# EAGLE design FubarStep_v12 (EAGLE 6.4)
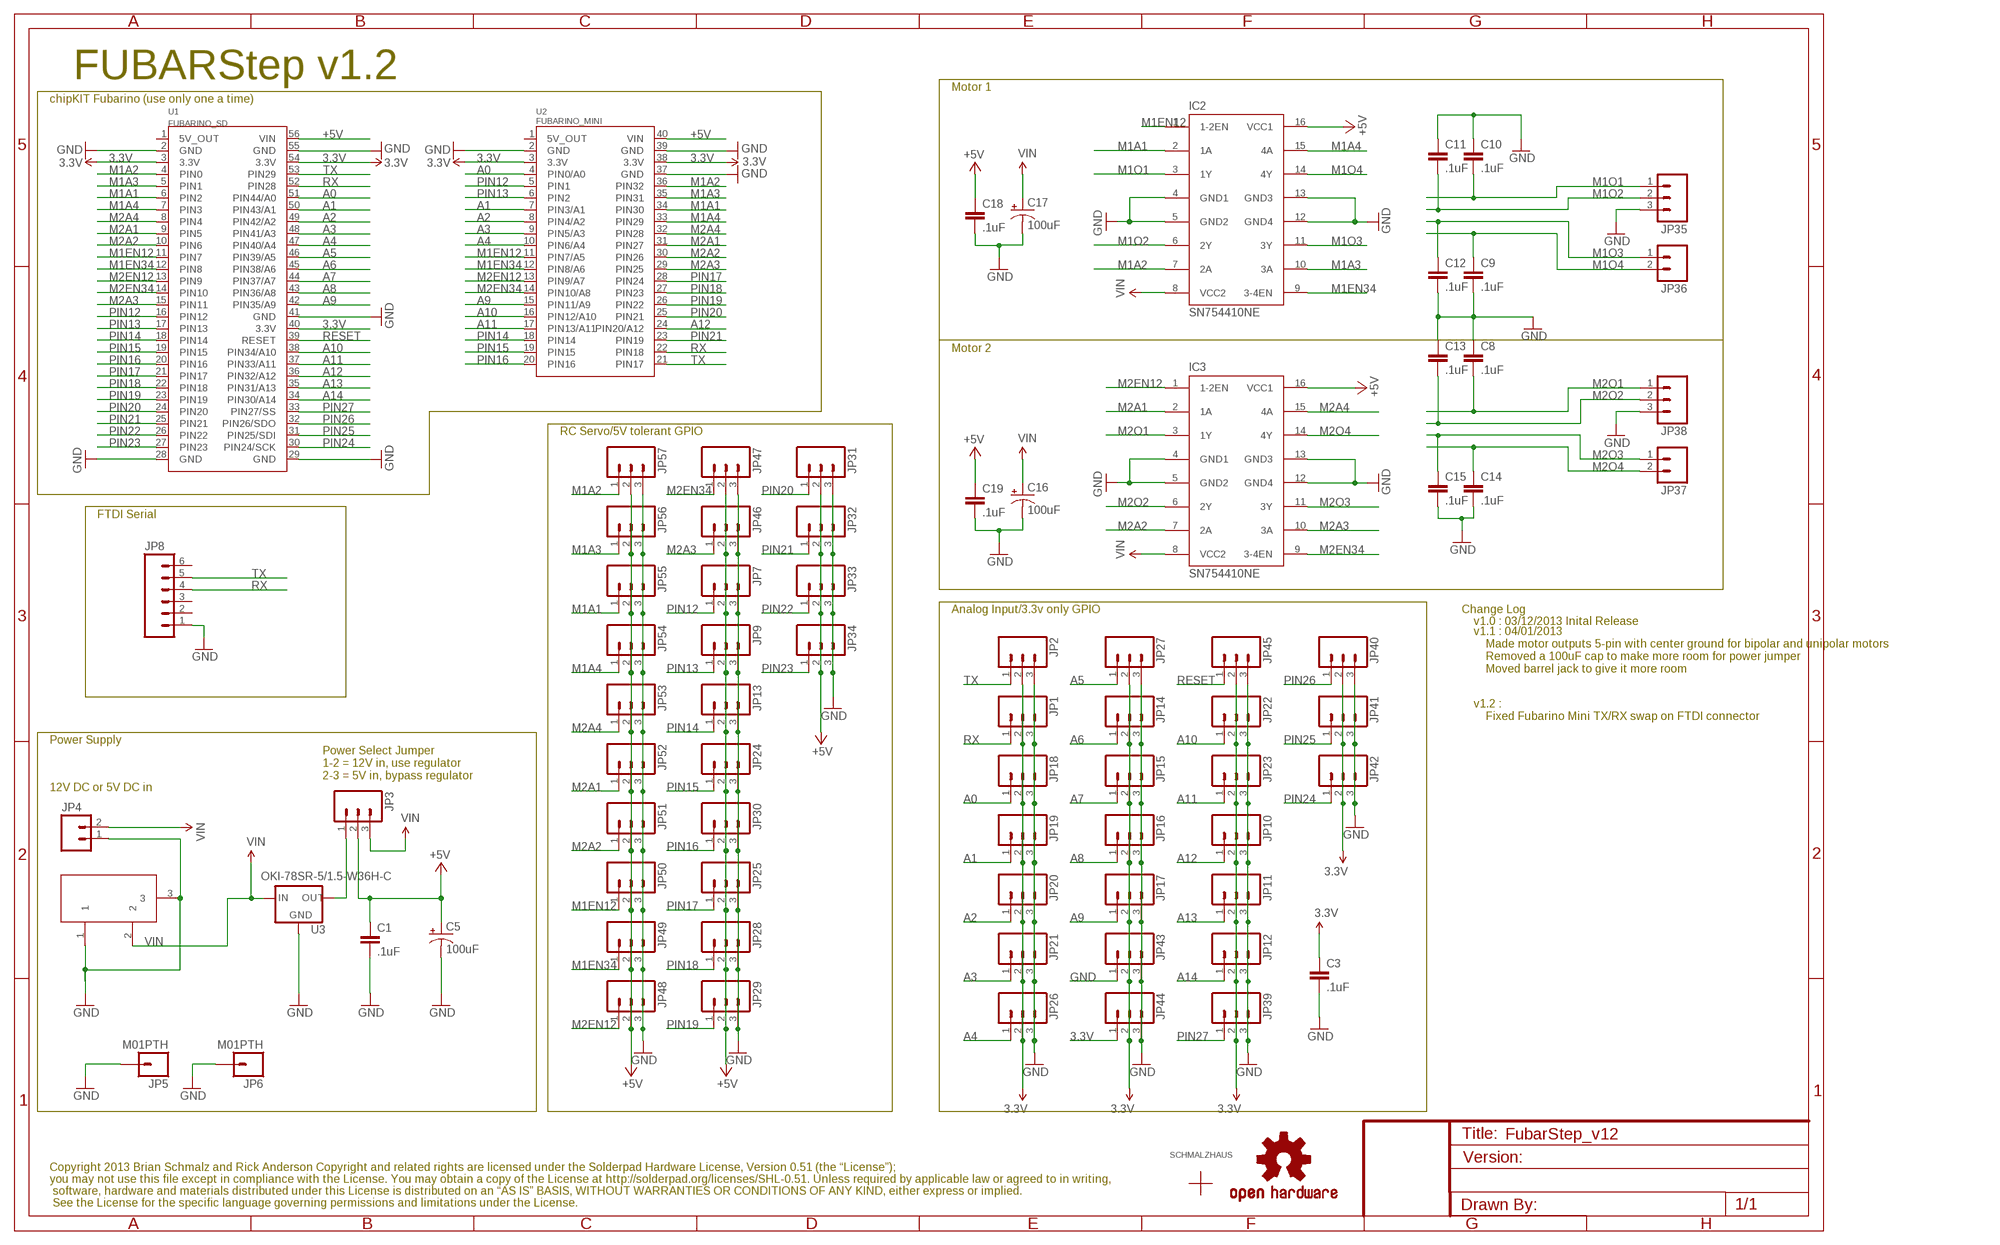
[diagram p0: schematic, sheet 1]

## Parts
C1  .1uF  CAPPTH  [CAP-PTH-SMALL]
C3  .1uF  CAPPTH  [CAP-PTH-SMALL]
C5  100uF  CAP_POLPTH1  [CPOL-RADIAL-100UF-25V]
C8  .1uF  CAPPTH  [CAP-PTH-SMALL]
C9  .1uF  CAPPTH  [CAP-PTH-SMALL]
C10  .1uF  CAPPTH  [CAP-PTH-SMALL]
C11  .1uF  CAPPTH  [CAP-PTH-SMALL]
C12  .1uF  CAPPTH  [CAP-PTH-SMALL]
C13  .1uF  CAPPTH  [CAP-PTH-SMALL]
C14  .1uF  CAPPTH  [CAP-PTH-SMALL]
C15  .1uF  CAPPTH  [CAP-PTH-SMALL]
C16  100uF  CAP_POLPTH1  [CPOL-RADIAL-100UF-25V]
C17  100uF  CAP_POLPTH1  [CPOL-RADIAL-100UF-25V]
C18  .1uF  CAPPTH  [CAP-PTH-SMALL]
C19  .1uF  CAPPTH  [CAP-PTH-SMALL]
IC2  SN754410NE  L293E  [DIL16]
IC3  SN754410NE  L293E  [DIL16]
JP1  M03PTH  [1X03]
JP2  M03PTH  [1X03]
JP3  M03PTH  [1X03]
JP4  M023.5MM  [SCREWTERMINAL-3.5MM-2]
JP5  M01PTH  [1X01]
JP6  M01PTH  [1X01]
JP7  M03PTH  [1X03]
JP8  M06LOCK  [1X06_LOCK]
JP9  M03PTH  [1X03]
JP10  M03PTH  [1X03]
JP11  M03PTH  [1X03]
JP12  M03PTH  [1X03]
JP13  M03PTH  [1X03]
JP14  M03PTH  [1X03]
JP15  M03PTH  [1X03]
JP16  M03PTH  [1X03]
JP17  M03PTH  [1X03]
JP18  M03PTH  [1X03]
JP19  M03PTH  [1X03]
JP20  M03PTH  [1X03]
JP21  M03PTH  [1X03]
JP22  M03PTH  [1X03]
JP23  M03PTH  [1X03]
JP24  M03PTH  [1X03]
JP25  M03PTH  [1X03]
JP26  M03PTH  [1X03]
JP27  M03PTH  [1X03]
JP28  M03PTH  [1X03]
JP29  M03PTH  [1X03]
JP30  M03PTH  [1X03]
JP31  M03PTH  [1X03]
JP32  M03PTH  [1X03]
JP33  M03PTH  [1X03]
JP34  M03PTH  [1X03]
JP35  M03SCREW  [SCREWTERMINAL-3.5MM-3]
JP36  M023.5MM  [SCREWTERMINAL-3.5MM-2]
JP37  M023.5MM  [SCREWTERMINAL-3.5MM-2]
JP38  M03SCREW  [SCREWTERMINAL-3.5MM-3]
JP39  M03PTH  [1X03]
JP40  M03PTH  [1X03]
JP41  M03PTH  [1X03]
JP42  M03PTH  [1X03]
JP43  M03PTH  [1X03]
JP44  M03PTH  [1X03]
JP45  M03PTH  [1X03]
JP46  M03PTH  [1X03]
JP47  M03PTH  [1X03]
JP48  M03PTH  [1X03]
JP49  M03PTH  [1X03]
JP50  M03PTH  [1X03]
JP51  M03PTH  [1X03]
JP52  M03PTH  [1X03]
JP53  M03PTH  [1X03]
JP54  M03PTH  [1X03]
JP55  M03PTH  [1X03]
JP56  M03PTH  [1X03]
JP57  M03PTH  [1X03]
LOGO1  OSHW-LOGOM  [OSHW-LOGO-M]
U1  FUBARINO_SD  [FUBARINO_SD]
U2  FUBARINO_MINI  [FUBARINO_MINI]
U3  OKI-78SR-5/1.5-W36H-C  V_REG_78XXSINK  [TO220-IGO]
U$1  SCHMALZHAUSSCHMALZHAUS_SMALL  [SCHMALZHAUS_SMALL]
X1  DC21MMX  [DC-21MM]

## Nets
3.3V: C3.1 JP1.2 JP2.2 JP10.2 JP11.2 JP12.2 JP14.2 JP15.2 JP16.2 JP17.2 JP18.2 JP19.2 JP20.2 JP21.2 JP22.2 JP23.2 JP26.2 JP27.2 JP39.2 JP40.2 JP41.2 JP42.2 JP43.2 JP44.1 JP44.2 JP45.2 U1.3(3.3V) U1.40(3.3V) U1.54(3.3V) U2.3(3.3V) U2.38(3.3V)
+5V: C1.1 C5.1(+) C18.1 C19.1 IC2.16(VCC1) IC3.16(VCC1) JP3.2 JP7.2 JP9.2 JP13.2 JP24.2 JP25.2 JP28.2 JP29.2 JP30.2 JP31.2 JP32.2 JP33.2 JP34.2 JP46.2 JP47.2 JP48.2 JP49.2 JP50.2 JP51.2 JP52.2 JP53.2 JP54.2 JP55.2 JP56.2 JP57.2 U1.56(VIN) U2.40(VIN)
A0: JP18.1 U1.51(PIN44/A0) U2.4(PIN0/A0)
A1: JP19.1 U1.50(PIN43/A1) U2.7(PIN3/A1)
A2: JP20.1 U1.49(PIN42/A2) U2.8(PIN4/A2)
A3: JP21.1 U1.48(PIN41/A3) U2.9(PIN5/A3)
A4: JP26.1 U1.47(PIN40/A4) U2.10(PIN6/A4)
A5: JP27.1 U1.46(PIN39/A5)
A6: JP14.1 U1.45(PIN38/A6)
A7: JP15.1 U1.44(PIN37/A7)
A8: JP16.1 U1.43(PIN36/A8)
A9: JP17.1 U1.42(PIN35/A9) U2.15(PIN11/A9)
A10: JP22.1 U1.38(PIN34/A10) U2.16(PIN12/A10)
A11: JP23.1 U1.37(PIN33/A11) U2.17(PIN13/A11)
A12: JP10.1 U1.36(PIN32/A12) U2.24(PIN20/A12)
A13: JP11.1 U1.35(PIN31/A13)
A14: JP12.1 U1.34(PIN30/A14)
GND: C1.2 C3.2 C5.2(-) C8.1 C9.2 C10.1 C11.1 C12.2 C13.1 C14.2 C15.2 C16.2(-) C17.2(-) C18.2 C19.2 IC2.4(GND1) IC2.5(GND2) IC2.12(GND4) IC2.13(GND3) IC3.4(GND1) IC3.5(GND2) IC3.12(GND4) IC3.13(GND3) JP1.3 JP2.3 JP4.1 JP5.1 JP6.1 JP7.3 JP8.1 JP9.3 JP10.3 JP11.3 JP12.3 JP13.3 JP14.3 JP15.3 JP16.3 JP17.3 JP18.3 JP19.3 JP20.3 JP21.3 JP22.3 JP23.3 JP24.3 JP25.3 JP26.3 JP27.3 JP28.3 JP29.3 JP30.3 JP31.3 JP32.3 JP33.3 JP34.3 JP35.3 JP38.3 JP39.3 JP40.3 JP41.3 JP42.3 JP43.1 JP43.3 JP44.3 JP45.3 JP46.3 JP47.3 JP48.3 JP49.3 JP50.3 JP51.3 JP52.3 JP53.3 JP54.3 JP55.3 JP56.3 JP57.3 U1.2(GND) U1.28(GND) U1.29(GND) U1.41(GND) U1.55(GND) U2.2(GND) U2.37(GND) U2.39(GND) U3.GND X1.1 X1.3
M1A1: IC2.2(1A) JP55.1 U1.6(PIN2) U2.34(PIN30)
M1A2: IC2.7(2A) JP57.1 U1.4(PIN0) U2.36(PIN32)
M1A3: IC2.10(3A) JP56.1 U1.5(PIN1) U2.35(PIN31)
M1A4: IC2.15(4A) JP54.1 U1.7(PIN3) U2.33(PIN29)
M1EN12: IC2.1(1-2EN) JP50.1 U1.11(PIN7) U2.11(PIN7/A5)
M1EN34: IC2.9(3-4EN) JP49.1 U1.12(PIN8) U2.12(PIN8/A6)
M1O1: C10.2 IC2.3(1Y) JP35.1
M1O2: C11.2 IC2.6(2Y) JP35.2
M1O3: C12.1 IC2.11(3Y) JP36.1
M1O4: C9.1 IC2.14(4Y) JP36.2
M2A1: IC3.2(1A) JP52.1 U1.9(PIN5) U2.31(PIN27)
M2A2: IC3.7(2A) JP51.1 U1.10(PIN6) U2.30(PIN26)
M2A3: IC3.10(3A) JP46.1 U1.15(PIN11) U2.29(PIN25)
M2A4: IC3.15(4A) JP53.1 U1.8(PIN4) U2.32(PIN28)
M2EN12: IC3.1(1-2EN) JP48.1 U1.13(PIN9) U2.13(PIN9/A7)
M2EN34: IC3.9(3-4EN) JP47.1 U1.14(PIN10) U2.14(PIN10/A8)
M2O1: C8.2 IC3.3(1Y) JP38.1
M2O2: C13.2 IC3.6(2Y) JP38.2
M2O3: C15.1 IC3.11(3Y) JP37.1
M2O4: C14.1 IC3.14(4Y) JP37.2
N$2: JP3.1 U3.OUT
PIN12: JP7.1 U1.16(PIN12) U2.5(PIN1)
PIN13: JP9.1 U1.17(PIN13) U2.6(PIN2)
PIN14: JP13.1 U1.18(PIN14) U2.18(PIN14)
PIN15: JP24.1 U1.19(PIN15) U2.19(PIN15)
PIN16: JP30.1 U1.20(PIN16) U2.20(PIN16)
PIN17: JP25.1 U1.21(PIN17) U2.28(PIN24)
PIN18: JP28.1 U1.22(PIN18) U2.27(PIN23)
PIN19: JP29.1 U1.23(PIN19) U2.26(PIN22)
PIN20: JP31.1 U1.24(PIN20) U2.25(PIN21)
PIN21: JP32.1 U1.25(PIN21) U2.23(PIN19)
PIN22: JP33.1 U1.26(PIN22)
PIN23: JP34.1 U1.27(PIN23)
PIN24: JP42.1 U1.30(PIN24/SCK)
PIN25: JP41.1 U1.31(PIN25/SDI)
PIN26: JP40.1 U1.32(PIN26/SDO)
PIN27: JP39.1 U1.33(PIN27/SS)
RESET: JP45.1 U1.39(RESET)
RX: JP1.1 JP8.4 U1.52(PIN28) U2.22(PIN18)
TX: JP2.1 JP8.5 U1.53(PIN29) U2.21(PIN17)
VIN: C16.1(+) C17.1(+) IC2.8(VCC2) IC3.8(VCC2) JP3.3 JP4.2 U3.IN X1.2
Unconnected: JP8.2 JP8.3 JP8.6 U1.1(5V_OUT) U2.1(5V_OUT)

## Notes on the sheet
- FUBARStep v1.2
- Motor 1
- chipKIT Fubarino (use only one a time)
- Motor 2
- RC Servo/5V tolerant GPIO
- FTDI Serial
- Analog Input/3.3v only GPIO | Change Log
- v1.0 : 03/12/2013 Inital Release
- v1.1 : 04/01/2013
      Made motor outputs 5-pin with center ground for bipolar and unipolar motors
      Removed a 100uF cap to make more room for power jumper
      Moved barrel jack to give it more room
- v1.2 :
      Fixed Fubarino Mini TX/RX swap on FTDI connector
- Power Supply
- Power Select Jumper
  1-2 = 12V in, use regulator
  2-3 = 5V in, bypass regulator
- 12V DC or 5V DC in
- Copyright 2013 Brian Schmalz and Rick Anderson Copyright and related rights are licensed under the Solderpad Hardware License, Version 0.51 (the “License”);
- you may not use this file except in compliance with the License. You may obtain a copy of the License at http://solderpad.org/licenses/SHL-0.51. Unless required by applicable law or agreed to in writing,
- software, hardware and materials distributed under this License is distributed on an “AS IS” BASIS, WITHOUT WARRANTIES OR CONDITIONS OF ANY KIND, either express or implied.
- See the License for the specific language governing permissions and limitations under the License.

## Library data of the parts
C1 C3 C8-C15 C18 C19 = SparkFun-Capacitors:CAP: Capacitor Standard 0603 ceramic capacitor, and 0.1" leaded capacitor.
C5 C16 C17 = SparkFun-Capacitors:CAP_POL: Capacitor Polarized These are standard SMD and PTH capacitors. Normally 10uF, 47uF, and 100uF in electrolytic and tantalum varieties. Always verify the external diameter of the through hole cap, it varies with capacity, voltage, and manufacturer. The EIA devices should be standard.
IC2 IC3 = texas:L293E: TI DEVICE; MF: Arrow Electronics; MPN: L293E; OC_FARNELL: 1467711; OC_NEWARK: 89K0732
JP1-JP3 JP7 JP9-JP35 JP38-JP57 = SparkFun-Connectors:M03: Header 3 Standard 3-pin 0.1" header. Use with straight break away headers (SKU : PRT-00116), right angle break away headers (PRT-00553), swiss pins (PRT-00743), machine pins (PRT-00117), and female headers (PRT-00115). Molex polarized connector foot print use with SKU : PRT-08232 with associated crimp pins and housings.
JP4 JP36 JP37 = SparkFun-Connectors:M02: Header 2 Standard 2-pin 0.1" header. Use with straight break away headers (SKU : PRT-00116), right angle break away headers (PRT-00553), swiss pins (PRT-00743), machine pins (PRT-00117), and female headers (PRT-00115). Molex polarized connector foot print use with SKU : PRT-08233 with associated crimp pins and housings.
JP5 JP6 = SparkFun-Connectors:M01: Header 1 Standard 1-pin 0.1" header. Use with straight break away headers (SKU : PRT-00116), right angle break away headers (PRT-00553), swiss pins (PRT-00743), machine pins (PRT-00117), and female headers (PRT-00115).
JP8 = SparkFun-Connectors:M06: Header 6 Standard 6-pin 0.1" header. Use with straight break away headers (SKU : PRT-00116), right angle break away headers (PRT-00553), swiss pins (PRT-00743), machine pins (PRT-00117), and female headers (PRT-00115). Molex polarized connector foot print use with SKU : PRT-08094 with associated crimp pins and housings. NOTES ON THE VARIANTS LOCK and LOCK_LONGPADS... This footprint was designed to help hold the alignment of a through-hole component (i.e. 6-pin header) while soldering it into place. You may notice that each hole has been shifted either up or down by 0.005 of an inch from it's more standard position (which is a perfectly straight line). This slight alteration caused the pins (the squares in the middle) to touch the edges of the holes. Because they are alternating, it causes a "brace" to hold the component in place. 0.005 has proven to be the perfect amount of "off-center" position when using our standard breakaway headers. Although looks a little odd when you look at the bare footprint, once you have a header in there, the alteration is very hard to notice. Also, if you push a header all the way into place, it is covered up entirely on the bottom side. This idea of altering the position of holes to aid alignment will be further integrated into the Sparkfun Library for other footprints. It can help hold any component with 3 or more connection pins.
LOGO1 = SparkFun-Aesthetics:OSHW-LOGO: Open Source Hardware Logo This logo indicates the piece of hardware it is found on incorporates a OSHW license and/or adheres to the definition of open source hardware found here: http://freedomdefined.org/OSHW
U1 = SchmalzHausPublic:FUBARINO_SD
U2 = SchmalzHausPublic:FUBARINO_MINI
U3 = SparkFun-PowerIC:V_REG_78XX: Voltage Regulator Standard 7805 5V regulator. IGO (Input Ground Output). Spark Fun Electronics SKU : COM-00107
U$1 = SchmalzHaus:SCHMALZHAUS
X1 = powersupply:DC21MM

## Net classes
0 default: width 0.152 mm, drill 0.305 mm, clearance 0.152 mm

## Board
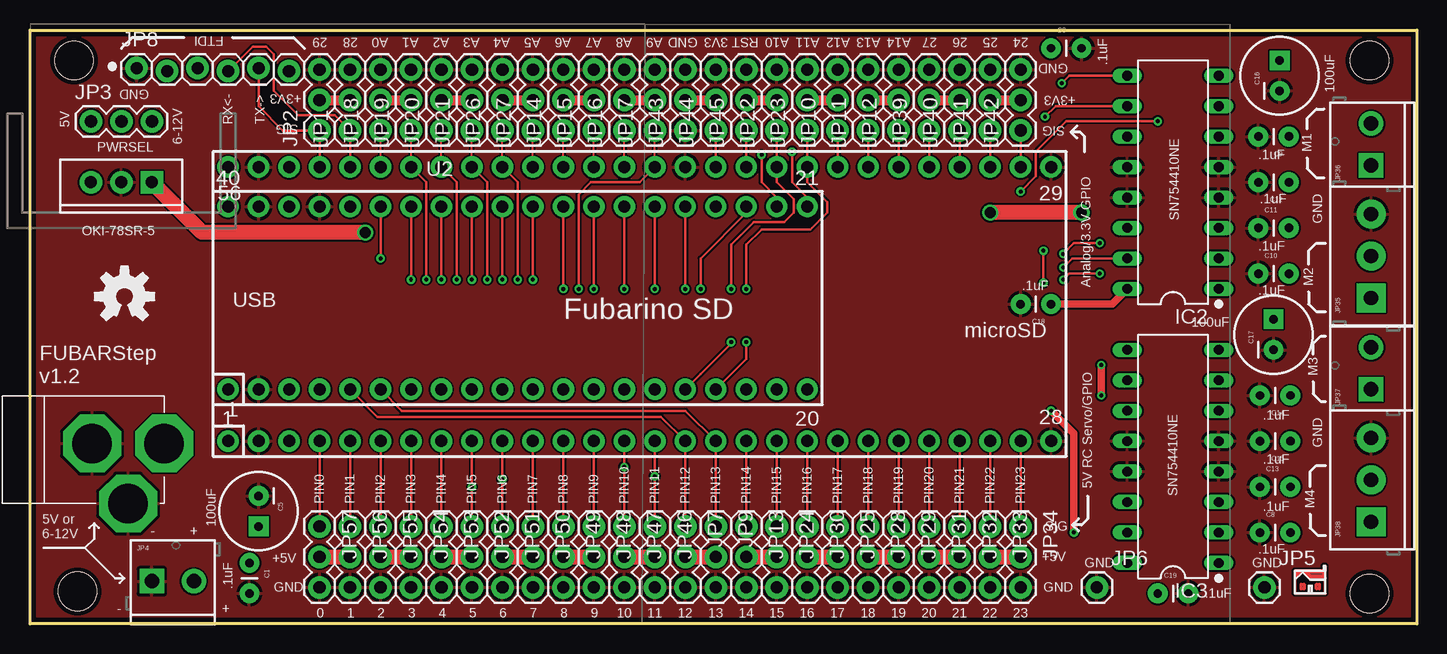
[diagram p1: board, top side]
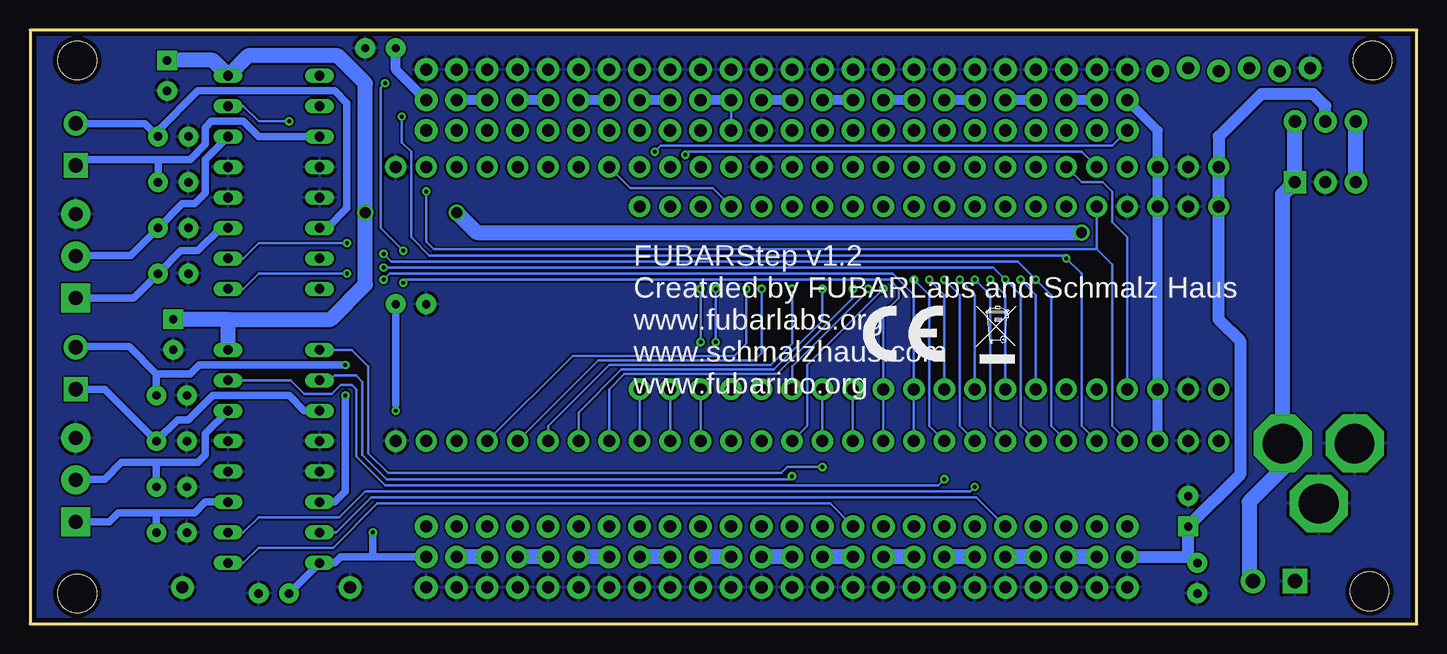
[diagram p2: board, bottom side, seen from below]

Size 115.57 x 49.53 mm. Coordinates in mm from the lower left corner, seen from the top.
Outline: 0,49.53 115.57,49.53 115.57,0 0,0 0,49.53
Copper layers (1*16): Top 0.0356mm / dielectric 1.5011mm / Bottom 0.0356mm
Design rules "LaenPCBOrder_BPSmods": minimum track width 6mil, minimum drill 13mil, track to track 6mil, track to pad 6mil, pad to pad 6mil, via to via 6mil, smd to smd 6mil, copper to edge 15mil, drill to drill 6mil, minimum pad ring 7mil, minimum via ring 7mil, stop-mask expansion 4mil, vias tented up to drill 30mil, thermal gap 10mil
Holes 3.2 mm at 111.63,46.99 111.63,2.54 3.68,46.99 3.95,2.71

### Footprints (pad centres in the part's own frame; a part is rotated, then mirrored left to right if it is on the bottom)
CAP-PTH-SMALL = drill 0.7 pad 1.651: 1 0,0; 2 2.54,0
CPOL-RADIAL-100UF-25V = drill 0.7 pad 1.651 square: 1 1.27,0 | drill 0.7 pad 1.651: 2 -1.27,0
DIL16 = drill 0.813 long: 1 -8.89,-3.81; 2 -6.35,-3.81; 3 -3.81,-3.81; 4 -1.27,-3.81; 5 1.27,-3.81; 6 3.81,-3.81; 7 6.35,-3.81; 8 8.89,-3.81; 9 8.89,3.81; 10 6.35,3.81; 11 3.81,3.81; 12 1.27,3.81; 13 -1.27,3.81; 14 -3.81,3.81; 15 -6.35,3.81; 16 -8.89,3.81
1X03 = drill 1.016 pad 1.88: 1 0,0; 2 2.54,0; 3 5.08,0
SCREWTERMINAL-3.5MM-2 = drill 1.2 pad 2.032 square: 1 0,0 | drill 1.2 pad 2.032: 2 3.5,0
1X01 = drill 1.016 pad 1.88: 1 0,0
1X06_LOCK = drill 1.016 pad 1.88: 1 0,0; 2 2.54,-0.254; 3 5.08,0; 4 7.62,-0.254; 5 10.16,0; 6 12.7,-0.254
SCREWTERMINAL-3.5MM-3 = drill 1.2 pad 2.413 square: 1 0,0 | drill 1.2 pad 2.413: 2 3.5,0; 3 7,0
FUBARINO_SD = drill 1 pad 1.778: 1 -34.29,-11.43; 2 -31.75,-11.43; 3 -29.21,-11.43; 4 -26.67,-11.43; 5 -24.13,-11.43; 6 -21.59,-11.43; 7 -19.05,-11.43; 8 -16.51,-11.43; 9 -13.97,-11.43; 10 -11.43,-11.43; 11 -8.89,-11.43; 12 -6.35,-11.43; 13 -3.81,-11.43; 14 -1.27,-11.43; 15 1.27,-11.43; 16 3.81,-11.43; 17 6.35,-11.43; 18 8.89,-11.43; 19 11.43,-11.43; 20 13.97,-11.43; 21 16.51,-11.43; 22 19.05,-11.43; 23 21.59,-11.43; 24 24.13,-11.43; 25 26.67,-11.43; 26 29.21,-11.43; 27 31.75,-11.43; 28 34.29,-11.43; 29 34.29,11.43; 30 31.75,11.43; 31 29.21,11.43; 32 26.67,11.43; 33 24.13,11.43; 34 21.59,11.43; 35 19.05,11.43; 36 16.51,11.43; 37 13.97,11.43; 38 11.43,11.43; 39 8.89,11.43; 40 6.35,11.43; 41 3.81,11.43; 42 1.27,11.43; 43 -1.27,11.43; 44 -3.81,11.43; 45 -6.35,11.43; 46 -8.89,11.43; 47 -11.43,11.43; 48 -13.97,11.43; 49 -16.51,11.43; 50 -19.05,11.43; 51 -21.59,11.43; 52 -24.13,11.43; 53 -26.67,11.43; 54 -29.21,11.43; 55 -31.75,11.43; 56 -34.29,11.43
FUBARINO_MINI = drill 1 pad 1.778: 1 -24.13,-7.62; 2 -21.59,-7.62; 3 -19.05,-7.62; 4 -16.51,-7.62; 5 -13.97,-7.62; 6 -11.43,-7.62; 7 -8.89,-7.62; 8 -6.35,-7.62; 9 -3.81,-7.62; 10 -1.27,-7.62; 11 1.27,-7.62; 12 3.81,-7.62; 13 6.35,-7.62; 14 8.89,-7.62; 15 11.43,-7.62; 16 13.97,-7.62; 17 16.51,-7.62; 18 19.05,-7.62; 19 21.59,-7.62; 20 24.13,-7.62; 21 24.13,7.62; 22 21.59,7.62; 23 19.05,7.62; 24 16.51,7.62; 25 13.97,7.62; 26 11.43,7.62; 27 8.89,7.62; 28 6.35,7.62; 29 3.81,7.62; 30 1.27,7.62; 31 -1.27,7.62; 32 -3.81,7.62; 33 -6.35,7.62; 34 -8.89,7.62; 35 -11.43,7.62; 36 -13.97,7.62; 37 -16.51,7.62; 38 -19.05,7.62; 39 -21.59,7.62; 40 -24.13,7.62
TO220-IGO = drill 1 pad 1.88: GND 0,0; OUT 2.54,0 | drill 1 pad 1.88 square: IN -2.54,0
DC-21MM = drill 3.302 pad 4.826 octagon: 1 -5.08,-3.353; 2 -0.076,-6.35; 3 -0.076,-0.356

### Placement (x,y rotation side)
C1  18.29,5.08 270 top
C3  85.09,48.01 0 top
C5  19.05,9.4 270 top
C8  102.49,7.62 0 top
C9  104.9,40.64 180 top
C10  102.36,29.21 0 top
C11  102.36,33.02 0 top
C12  104.9,36.83 180 top
C13  102.49,11.43 0 top
C14  105.03,19.05 180 top
C15  105.03,15.24 180 top
C16  104.14,45.72 90 top
C17  103.63,24.13 90 top
C18  85.09,26.67 180 top
C19  93.98,2.54 0 top
IC2  95.25,36.83 90 top
IC3  95.25,13.97 90 top
JP1  26.67,41.15 90 top
JP2  24.13,41.15 90 top
JP3  5.08,41.91 0 top
JP4  10.16,3.56 0 top
JP5  102.87,3.05 0 top
JP6  88.9,3.05 0 top
JP7  54.61,8.13 270 top
JP8  8.89,46.35 0 top
JP9  57.15,8.13 270 top
JP10  67.31,41.15 90 top
JP11  69.85,41.15 90 top
JP12  72.39,41.15 90 top
JP13  59.69,8.13 270 top
JP14  44.45,41.15 90 top
JP15  46.99,41.15 90 top
JP16  49.53,41.15 90 top
JP17  52.07,41.15 90 top
JP18  29.21,41.15 90 top
JP19  31.75,41.15 90 top
JP20  34.29,41.15 90 top
JP21  36.83,41.15 90 top
JP22  62.23,41.15 90 top
JP23  64.77,41.15 90 top
JP24  62.23,8.13 270 top
JP25  67.31,8.13 270 top
JP26  39.37,41.15 90 top
JP27  41.91,41.15 90 top
JP28  69.85,8.13 270 top
JP29  72.39,8.13 270 top
JP30  64.77,8.13 270 top
JP31  74.93,8.13 270 top
JP32  77.47,8.13 270 top
JP33  80.01,8.13 270 top
JP34  82.55,8.13 270 top
JP35  111.76,27.18 90 top
JP36  111.76,38.23 90 top
JP37  111.76,19.56 90 top
JP38  111.76,8.51 90 top
JP39  74.93,41.15 90 top
JP40  77.47,41.15 90 top
JP41  80.01,41.15 90 top
JP42  82.55,41.15 90 top
JP43  54.61,41.15 90 top
JP44  57.15,41.15 90 top
JP45  59.69,41.15 90 top
JP46  52.07,8.13 270 top
JP47  49.53,8.13 270 top
JP48  46.99,8.13 270 top
JP49  44.45,8.13 270 top
JP50  41.91,8.13 270 top
JP51  39.37,8.13 270 top
JP52  36.83,8.13 270 top
JP53  34.29,8.13 270 top
JP54  31.75,8.13 270 top
JP55  29.21,8.13 270 top
JP56  26.67,8.13 270 top
JP57  24.13,8.13 270 top
LOGO1  7.87,27.3 0 top
U1  50.8,26.67 0 top
U2  40.64,27.18 0 top
U3  7.62,36.83 180 top
U$1  106.68,2.54 0 top
U$2  [ROHS_GARBAGE_5MM]  36.7,21.72 0 bottom
U$3  [CE_5MM]  42.8,24.26 0 bottom
X1  4.83,15.11 90 top

### Tracks (layer width: path | path; a pad name or v marks a point on that pad's centre or on a via)
3.3V
  Top 0.203: U1.40 JP44.1
  Top 0.813: JP2.2 JP1.2 | JP18.2 JP19.2 | JP20.2 JP21.2 | JP26.2 JP27.2 | JP14.2 JP15.2 | JP16.2 JP17.2 | JP43.2 JP44.2 | JP45.2 JP22.2 | JP23.2 JP10.2 | JP11.2 JP12.2 | JP39.2 JP40.2 | JP41.2 JP42.2
  Bottom 0.203: JP44.2 JP44.1
  Bottom 0.813: U1.3 U2.3 U2.38 U1.54 21.59,41.15 JP2.2 | JP1.2 JP18.2 | JP19.2 JP20.2 | JP21.2 JP26.2 | JP27.2 JP14.2 | JP15.2 JP16.2 | JP17.2 JP43.2 | JP44.2 JP45.2 | JP22.2 JP23.2 | JP10.2 JP11.2 | JP12.2 JP39.2 | JP40.2 JP41.2 | JP42.2 85.09,46.23 C3.1
+5V  (via drill 0.33)
  Top 0.61: C18.1 90.17,26.67 IC2.16 | v85.09,17.78 87,15.88 v87,7.62
  Top 1.27: JP57.2 JP56.2 | JP55.2 JP54.2 | JP53.2 JP52.2 | JP51.2 JP50.2 | JP49.2 JP48.2 | JP47.2 JP46.2 | JP7.2 JP9.2 | JP13.2 JP24.2 | JP30.2 JP25.2 | JP28.2 JP29.2 | JP31.2 JP32.2 | JP33.2 JP34.2
  Bottom 0.203: 85.09,18.29 v85.09,17.78
  Bottom 0.61: C19.1 IC3.16 90.17,5.08 89.66,5.59 87,5.59 | 85.09,18.29 C18.1 | C1.1 19.05,5.84 19.3,5.59 | JP34.2 87,5.59 | v87,7.62 87,5.59
  Bottom 1.016: 19.05,5.84 C5.1 14.73,12.45 14.73,23.62 16.51,25.4 U2.40 U1.56 16.51,40.64 12.95,44.2 8.64,44.2 7.62,43.18 JP3.2 | JP57.2 19.3,5.59
  Bottom 1.27: JP56.2 JP55.2 | JP54.2 JP53.2 | JP52.2 JP51.2 | JP50.2 JP49.2 | JP48.2 JP47.2 | JP46.2 JP7.2 | JP9.2 JP13.2 | JP24.2 JP30.2 | JP25.2 JP28.2 | JP29.2 JP31.2 | JP32.2 JP33.2
A0
  Top 0.152: U1.51 JP18.1
  Bottom 0.203: U2.4 24.13,32.26 25.4,33.53 25.4,36.07 26.16,36.83 27.94,36.83 U1.51
A1  (via drill 0.33)
  Top 0.152: U1.50 JP19.1
  Top 0.203: v33.02,28.7 33.02,36.83 U1.50
  Bottom 0.203: U2.7 31.75,27.43 v33.02,28.7
A2  (via drill 0.33)
  Top 0.152: U1.49 JP20.1
  Top 0.203: v35.56,28.7 35.56,36.83 U1.49
  Bottom 0.203: U2.8 34.29,27.43 v35.56,28.7
A3  (via drill 0.33)
  Top 0.152: U1.48 JP21.1
  Top 0.203: v38.1,28.7 38.1,36.83 U1.48
  Bottom 0.203: U2.9 36.83,27.43 v38.1,28.7
A4  (via drill 0.33)
  Top 0.152: U1.47 JP26.1
  Top 0.203: v40.64,28.7 40.64,36.83 U1.47
  Bottom 0.203: U2.10 39.37,27.43 v40.64,28.7
A5
  Top 0.152: U1.46 JP27.1
A6
  Top 0.152: U1.45 JP14.1
A7
  Top 0.152: U1.44 JP15.1
A8
  Top 0.152: U1.43 JP16.1
A9  (via drill 0.33)
  Top 0.152: U1.42 JP17.1
  Top 0.203: v45.72,27.94 45.72,35.81 46.74,36.83 50.8,36.83 U1.42
  Bottom 0.203: U2.15 52.07,21.46 45.72,27.81 v45.72,27.94
A10  (via drill 0.33)
  Top 0.203: U2.16 55.88,20.83 58.42,23.37 v58.42,23.5 | v58.42,27.94 58.42,31.62 60.33,33.53 62.87,33.53 63.63,34.29 63.63,35.43 62.23,36.83 U1.38 JP22.1
  Bottom 0.203: v58.42,23.5 v58.42,27.94
A11  (via drill 0.33)
  Top 0.203: U2.17 59.69,22.1 v59.69,23.5 | v59.69,27.94 59.69,31.62 60.96,32.89 65.02,32.89 66.42,34.29 66.42,35.18 64.77,36.83 U1.37 JP23.1
  Bottom 0.203: v59.69,23.5 v59.69,27.94
A12
  Top 0.203: JP10.1 U1.36
  Bottom 0.203: U2.24 58.67,36.32 65.53,36.32 U1.36
A13
  Top 0.203: JP11.1 U1.35
A14
  Top 0.203: JP12.1 U1.34
GND
  pour Bottom (rank 2): 0,49.53 115.57,49.53 115.57,0 0,0
  pour Top (rank 2): 0,49.53 115.57,49.53 115.57,0 0,0
M1A1  (via drill 0.33)
  Top 0.203: v89.15,31.75 87,31.75 v86.11,30.86 | U2.34 v31.75,28.7 | U1.6 JP55.1
  Bottom 0.203: IC2.2 97.79,30.48 96.52,31.75 v89.15,31.75 | v86.11,30.86 85.47,30.23 33.27,30.23 v31.75,28.7 30.48,27.43 30.48,16.51 U1.6
M1A2  (via drill 0.33)
  Top 0.203: v93.98,41.91 86.36,41.91 83.82,39.37 83.82,37.34 v82.55,36.07 | U1.4 JP57.1
  Bottom 0.203: IC2.7 97.79,43.18 96.52,41.91 v93.98,41.91 | v82.55,36.07 82.55,31.88 81.92,31.24 26.67,31.24 | U1.4 25.4,16.51 25.4,29.97 26.67,31.24 | 26.67,31.24 U2.36
M1A3  (via drill 0.33)
  Top 0.203: IC2.10 85.47,43.18 v84.58,42.29 | U2.35 v29.21,30.48 | U1.5 JP56.1
  Bottom 0.203: v84.58,42.29 84.58,40.13 83.82,39.37 83.82,32.26 82.3,30.73 29.46,30.73 v29.21,30.48 27.94,29.21 27.94,16.51 U1.5
M1A4  (via drill 0.33)
  Top 0.203: IC2.15 86.87,30.48 v86.11,29.72 | U2.33 v34.29,28.7 | U1.7 JP54.1
  Bottom 0.203: U1.7 33.02,16.51 33.02,27.43 v34.29,28.7 35.31,29.72 v86.11,29.72
M1EN12  (via drill 0.33)
  Top 0.203: v89.15,29.21 86.61,29.21 v86.11,28.7 | U1.11 JP50.1
  Bottom 0.203: IC2.1 97.79,27.94 96.52,29.21 v89.15,29.21 | v86.11,28.7 85.6,29.21 43.69,29.21 41.91,27.43 U2.11 U1.11
M1EN34  (via drill 0.33)
  Top 0.203: IC2.9 86.61,45.72 v85.98,45.09 | U1.12 JP49.1 | v84.45,31.11 v84.45,28.45
  Bottom 0.203: v85.98,45.09 86.36,44.7 86.36,33.02 v84.45,31.11 | U1.12 U2.12 44.45,25.91 43.18,27.18 43.18,27.94 43.94,28.7 84.2,28.7 v84.45,28.45
M1O1
  Bottom 0.61: IC2.3 99.69,33.02 101.6,31.11 103,31.11 C10.2 106.93,27.18 JP35.1
M1O2
  Bottom 0.61: IC2.6 100.97,38.73 100.97,35.94 101.85,35.05 102.87,35.05 C11.2 107.19,30.73 111.7,30.73 JP35.2
M1O3
  Bottom 0.61: IC2.11 96.52,40.64 97.79,41.91 100.46,41.91 100.97,41.4 100.97,40.01 102.23,38.73 104.78,38.73 | 104.78,38.73 111.25,38.73 JP36.1 | C12.1 104.9,38.61 104.78,38.73
M1O4
  Bottom 0.61: IC2.14 90.81,33.02 89.15,34.67 89.15,43.43 90.17,44.45 101.6,44.45 104.9,41.15 C9.1 105.99,41.73 JP36.2
M2A1  (via drill 0.33)
  Top 0.203: U2.31 v39.37,28.7 | U1.9 v36.83,11.43 JP52.1
  Bottom 0.203: IC3.2 97.79,7.62 96.52,8.89 89.79,8.89 87.63,11.05 37.21,11.05 v36.83,11.43 | v39.37,28.7 38.1,27.43 38.1,16.51 U1.9
M2A2  (via drill 0.33)
  Top 0.203: U2.30 v41.91,28.7 | U1.10 v39.37,12.06 JP51.1
  Bottom 0.203: IC3.7 93.85,20.32 92.71,19.18 90.42,19.18 89.66,19.94 88.77,19.94 88.39,19.56 88.39,13.97 85.98,11.56 39.88,11.56 v39.37,12.06 | U1.10 40.64,16.51 40.64,27.43 v41.91,28.7
M2A3  (via drill 0.33)
  Top 0.203: v44.45,27.94 U2.29 | U1.15 v52.07,12.32 JP46.1
  Bottom 0.203: v52.07,12.32 52.32,12.06 85.85,12.06 87.88,14.1 87.88,20.19 88.39,20.7 90.17,20.7 90.55,20.32 IC3.10 | U1.15 50.8,16.51 50.8,21.59 v44.45,27.94
M2A4  (via drill 0.33)
  Top 0.203: U2.32 v36.83,28.7 | U1.8 JP53.1
  Bottom 0.203: IC3.15 90.04,7.62 87.12,10.54 36.7,10.54 JP53.1 | v36.83,28.7 35.56,27.43 35.56,16.51 U1.8
M2EN12
  Top 0.203: U1.13 JP48.1
  Bottom 0.203: IC3.1 97.79,5.08 96.52,6.35 90.3,6.35 86.61,10.03 48.9,10.03 JP48.1 | U2.13 U1.13
M2EN34  (via drill 0.33)
  Top 0.203: U1.14 v49.53,13.08 JP47.1
  Bottom 0.203: v49.53,13.08 52.45,13.08 52.96,12.57 85.72,12.57 87.38,14.22 87.38,21.46 88.77,22.86 IC3.9 | U2.14 U1.14
M2O1
  Bottom 0.61: IC3.3 100.97,10.16 101.85,9.27 105.03,9.27 | 105.03,9.27 108.2,9.27 108.97,8.51 JP38.1 | C8.2 105.03,9.27
M2O2
  Bottom 0.61: IC3.6 100.97,15.88 100.97,14.1 101.6,13.46 105.03,13.46 | 105.03,13.46 107.95,13.46 109.35,12.06 111.7,12.06 JP38.2 | C13.2 105.03,13.46
M2O3
  Bottom 0.61: IC3.11 92.71,17.78 93.98,19.05 100.33,19.05 102.36,17.02 103.25,17.02 C15.1 109.35,19.56 JP37.1
M2O4  (via drill 0.33)
  Top 0.61: v89.28,21.59 v89.28,19.05
  Bottom 0.61: v89.28,21.59 101.47,21.59 102.23,20.83 105.03,20.83 | 105.03,20.83 107.31,23.11 111.7,23.11 JP37.2 | C14.1 105.03,20.83 | v89.28,19.05 89.28,11.05 90.17,10.16 IC3.14
N$2
  Bottom 1.27: U3.OUT JP3.1
PIN12
  Top 0.203: U2.5 28.96,17.27 52.58,17.27 U1.16 JP7.1
PIN13
  Top 0.203: U2.6 30.99,17.78 54.61,17.78 U1.17 JP9.1
PIN14
  Top 0.203: U1.18 JP13.1
  Bottom 0.203: U2.18 U1.18
PIN15
  Top 0.203: U1.19 JP24.1
  Bottom 0.203: U2.19 U1.19
PIN16
  Top 0.203: U1.20 JP30.1
  Bottom 0.203: U2.20 U1.20
PIN17  (via drill 0.33)
  Top 0.203: U2.28 v46.99,27.94 | U1.21 JP25.1
  Bottom 0.203: v46.99,27.94 46.99,27.18 53.34,20.83 66.04,20.83 67.31,19.56 U1.21
PIN18  (via drill 0.33)
  Top 0.203: U2.27 v49.53,27.94 | U1.22 JP28.1
  Bottom 0.203: v49.53,27.94 49.53,25.27 53.59,21.21 66.29,21.21 69.85,17.65 U1.22
PIN19  (via drill 0.33)
  Top 0.203: U2.26 v52.07,27.94 | U1.23 JP29.1
  Bottom 0.203: v52.07,27.94 52.07,23.37 53.85,21.59 67.31,21.59 72.39,16.51 U1.23
PIN20  (via drill 0.33)
  Top 0.203: U2.25 v54.61,27.94 | U1.24 JP31.1
  Bottom 0.203: v54.61,27.94 54.61,22.61 55.24,21.97 68.2,21.97 U1.24
PIN21  (via drill 0.33)
  Top 0.203: U2.23 59.69,34.29 55.88,30.48 v55.88,27.94 | U1.25 JP32.1
  Bottom 0.203: v55.88,27.94 55.88,23.37 56.9,22.35 70.36,22.35 U1.25
PIN22
  Top 0.203: U1.26 JP33.1
PIN23
  Top 0.203: U1.27 JP34.1
PIN24
  Top 0.203: JP42.1 U1.30
PIN25
  Top 0.203: JP41.1 U1.31
PIN26
  Top 0.203: JP40.1 U1.32
PIN27
  Top 0.203: JP39.1 U1.33
RESET
  Top 0.203: U1.39 JP45.1
RX  (via drill 0.33)
  Top 0.203: U1.52 JP1.1 25.4,42.42 22.35,42.42 20.32,44.45 20.32,47.5 19.68,48.13 18.54,48.13 JP8.4 | U2.22 62.23,35.56 60.96,36.83 v60.96,39.12
  Bottom 0.203: v60.96,39.12 60.71,39.37 27.94,39.37 U1.52
TX  (via drill 0.33)
  Top 0.203: U1.53 JP2.1 21.08,41.15 19.05,43.18 JP8.5 | U2.21 64.77,35.56 63.5,36.83 v63.5,39.37
  Bottom 0.203: v63.5,39.37 62.99,39.88 25.4,39.88 JP2.1
VIN  (via drill 0.9)
  Top 1.27: v27.94,32.64 14.35,32.64 U3.IN | v87.63,34.29 v80.01,34.29
  Bottom 1.27: 99.06,25.4 90.53,25.4 87.63,28.3 v87.63,34.29 87.63,45.09 89.92,47.37 97.41,47.37 IC2.8 100.33,46.99 C16.1 | 99.06,25.4 C17.1 | IC3.8 99.06,25.4 | JP3.3 U3.IN 11.18,35.81 X1.2 11.18,12.95 13.97,10.16 13.97,3.87 JP4.2 | v80.01,34.29 78.36,32.64 v27.94,32.64

### Text on the board
tPlace: FTDI | 29 | 28 | A0 | A1 | A2 | A3 | A4 | A5 | A6 | A7 | A8 | A9 | GND | 3V3 | RST | A10 | A11 | A12 | A13 | A14 | 27 | 26 | 25 | 24 | GND | .1uF | GND | +3V3 | +3V3 | 100uF | RX<- | TX-> | SIG | SIG | 5V | 6-12V | PWRSEL | .1uF | M1 | .1uF | SN754410NE | GND | OKI-78SR-5 | .1uF | .1uF | Analog/3.3V GPIO | M2 | .1uF | 100uF | M3 | FUBARStep / v1.2 | .1uF | GND | .1uF | 5V RC Servo/GPIO | SN754410NE | PIN0 | PIN1 | PIN2 | PIN3 | PIN4 | PIN5 | PIN6 | PIN7 | PIN8 | PIN9 | PIN10 | PIN11 | PIN12 | PIN13 | PIN14 | PIN15 | PIN16 | PIN17 | PIN18 | PIN19 | PIN20 | PIN21 | PIN22 | PIN23 | M4 | .1uF | 100uF | SIG | 5V or / 6-12V | - | + | .1uF | +5V | +5V | GND | GND | .1uF | GND | GND | .1uF | - | + | 0 | 1 | 2 | 3 | 4 | 5 | 6 | 7 | 8 | 9 | 10 | 11 | 12 | 13 | 14 | 15 | 16 | 17 | 18 | 19 | 20 | 21 | 22 | 23
bPlace: FUBARStep v1.2 / Creatded by FUBARLabs and Schmalz Haus / www.fubarlabs.org / www.schmalzhaus.com / www.fubarino.org
Document: ANALOG INPUTS/3.3V GPIO | FTDI | SERVO OUTPUTS/5V GPIO
214bmp: D:/SmartProjects/Snc/a4_bn_logo2.bmp